# EAGLE design breakout (EAGLE 6.5.0)
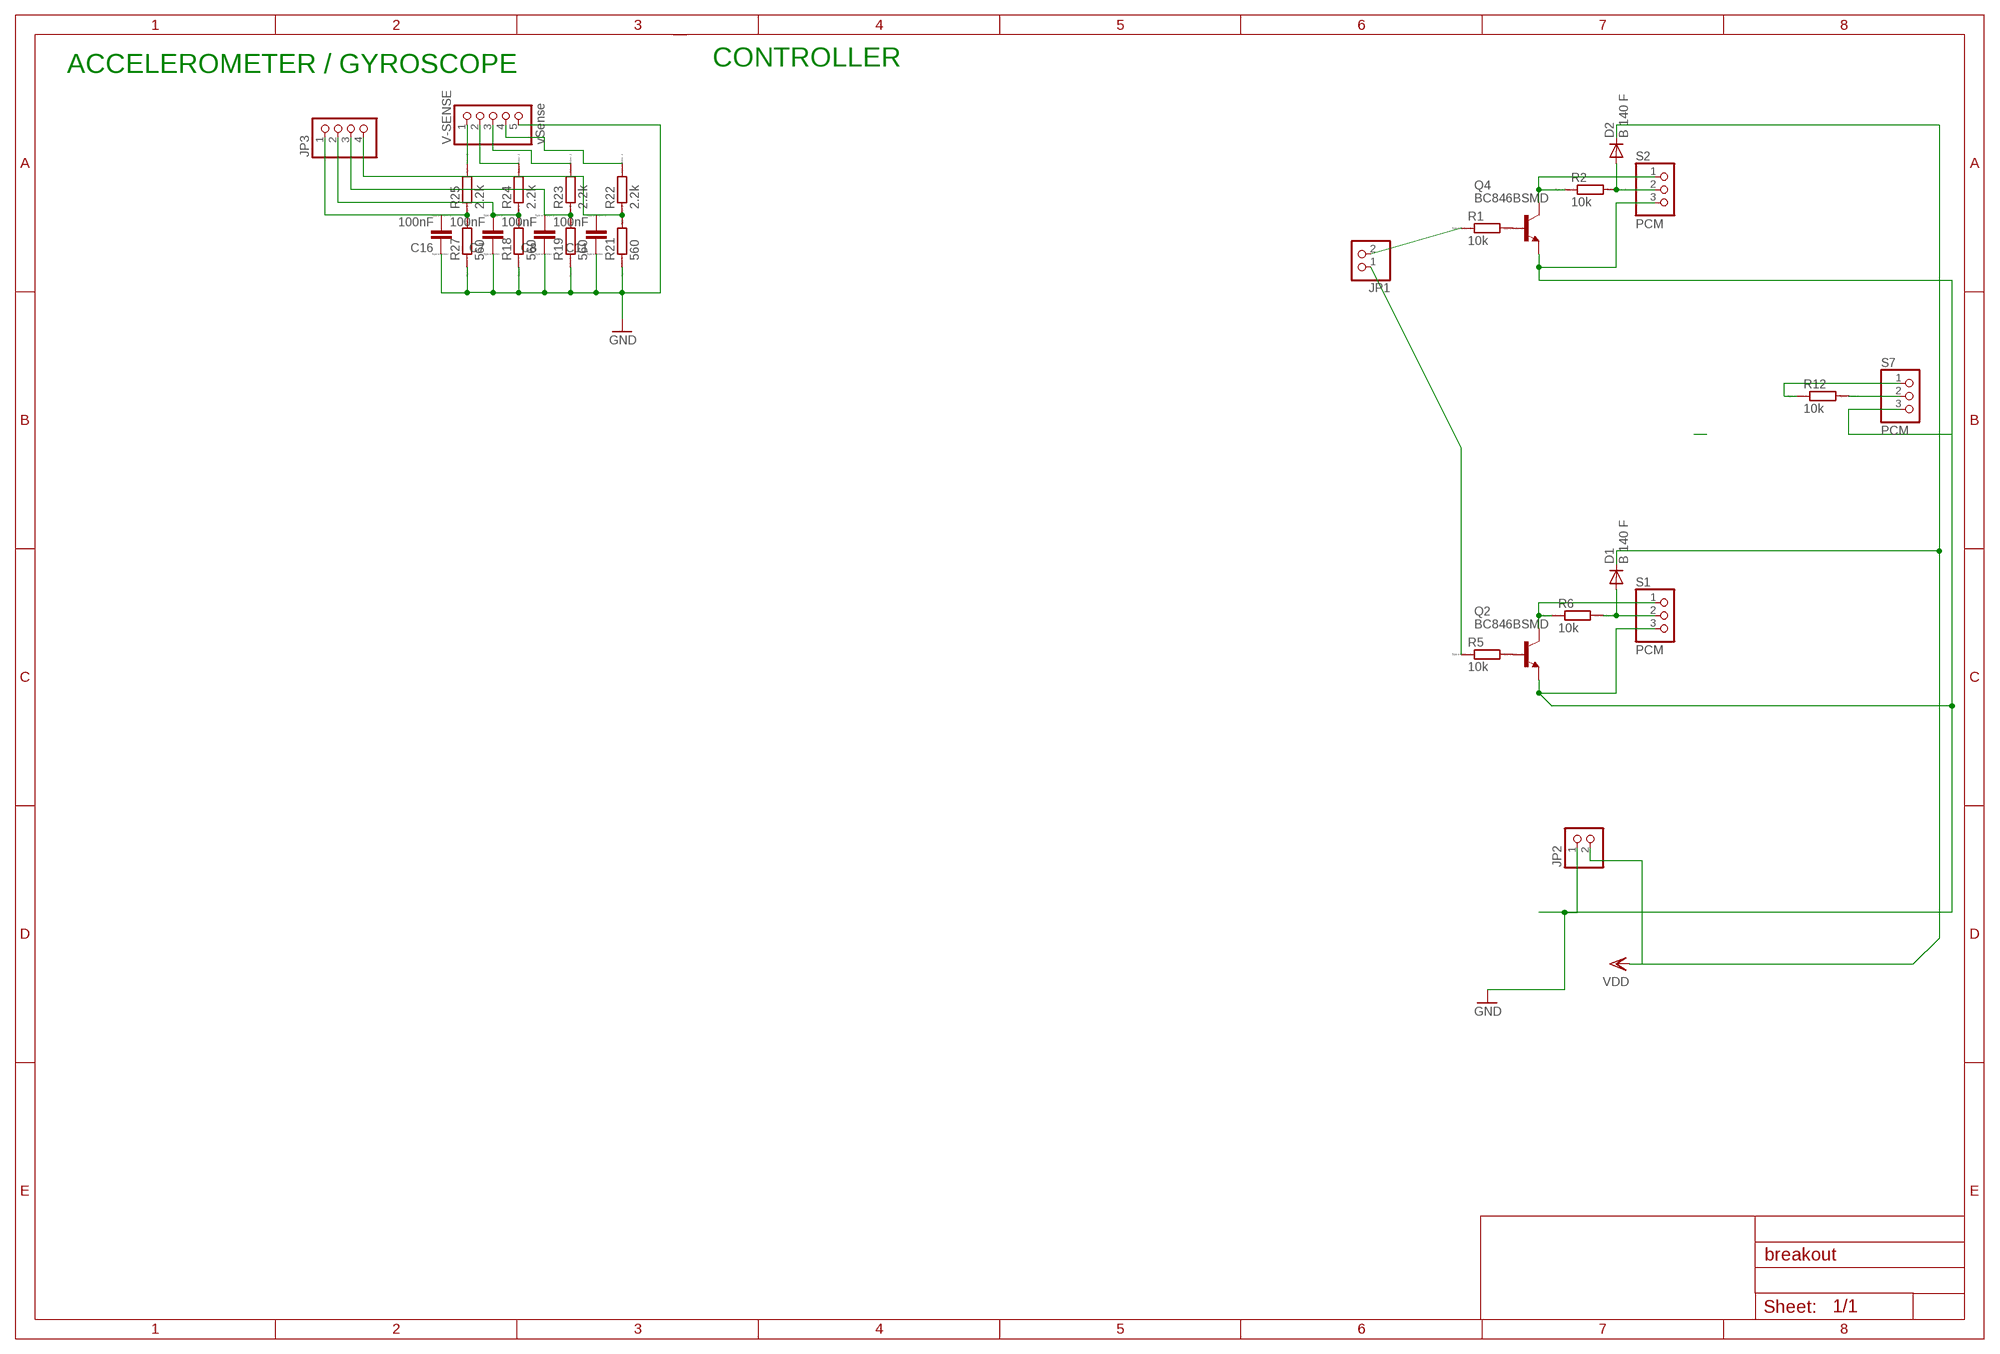
[diagram p0: schematic, sheet 1]

## Parts
C7  100nF  CC0603  [C0603]
C8  100nF  CC0603  [C0603]
C11  100nF  CC0603  [C0603]
C16  100nF  CC0603  [C0603]
D1  B 140 F  CGRM4001-G  [SOD-123_MINI-SMA]
D2  B 140 F  CGRM4001-G  [SOD-123_MINI-SMA]
JP1  PINHD-1X2  [1X02]
JP2  PINHD-1X2  [1X02]
JP3  PINHD-1X4  [1X04]
Q2  BC846BSMD  [SOT23]
Q4  BC846BSMD  [SOT23]
R1  10k  RR0603  [R0603]
R2  10k  RR0603  [R0603]
R5  10k  RR0603  [R0603]
R6  10k  RR0603  [R0603]
R12  10k  RR0603  [R0603]
R18  560  RR0603  [R0603]
R19  560  RR0603  [R0603]
R21  560  RR0603  [R0603]
R22  2.2k  RR0603  [R0603]
R23  2.2k  RR0603  [R0603]
R24  2.2k  RR0603  [R0603]
R25  2.2k  RR0603  [R0603]
R27  560  RR0603  [R0603]
S1  PCM  PINHD-1X3  [1X03]
S2  PCM  PINHD-1X3  [1X03]
S7  PCM  PINHD-1X3  [1X03]
V-SENSE  vSense  PINHD-1X5/90  [1X05/90]

## Nets
GND: C7.1 C8.1 C11.1 C16.1 JP2.1 Q2.2(E) Q4.2(E) R18.1 R19.1 R21.1 R27.1 S1.3 S2.3 S7.3 V-SENSE.5
N$1: Q4.1(B) R1.2
N$5: Q2.3(C) R6.1 S1.1
N$6: D1.A R6.2 S1.2
N$7: Q2.1(B) R5.2
N$14: Q4.3(C) R2.1 S2.1
N$15: D2.A R2.2 S2.2
N$16: R12.1 S7.1
N$17: R12.2 S7.2
N$25: JP1.2 R1.1
N$29: JP1.1 R5.1
N$42: R24.2 V-SENSE.2
N$43: R23.2 V-SENSE.3
N$44: R22.2 V-SENSE.4
N$50: R25.2 V-SENSE.1
PB0: C16.2 JP3.1 R25.1 R27.2
PB1: C7.2 JP3.2 R18.2 R24.1
PB2: C8.2 JP3.3 R19.2 R23.1
PB3: C11.2 JP3.4 R21.2 R22.1
VDD: D1.C D2.C JP2.2

## Notes on the sheet
- ACCELEROMETER / GYROSCOPE | CONTROLLER

## Library data of the parts
C7 C8 C11 C16 = eagle-ltspice:C: CAPACITOR, European symbol; SPICEMODEL: NONE; SPICEPREFIX: C
D1 D2 = diode:CGRM400*-G: Molded plasitc,JEDEC SOD-123/Mini SMA Source: Comchip CGRM4001-G.pdf
JP1 JP2 = pinhead:PINHD-1X2: PIN HEADER
JP3 = pinhead:PINHD-1X4: PIN HEADER
Q2 Q4 = transistor-npn:BC846*: NPN Transistor
R1 R2 R5 R6 R12 R18 R19 R21-R25 R27 = eagle-ltspice:R: RESISTOR, European symbol; SPICEMODEL: NONE; SPICEPREFIX: R
S1 S2 S7 = pinhead:PINHD-1X3: PIN HEADER
V-SENSE = pinhead:PINHD-1X5: PIN HEADER

## Net classes
0 gnd: width 0.305 mm, drill 0.5 mm, clearance 0.203 mm

## Board
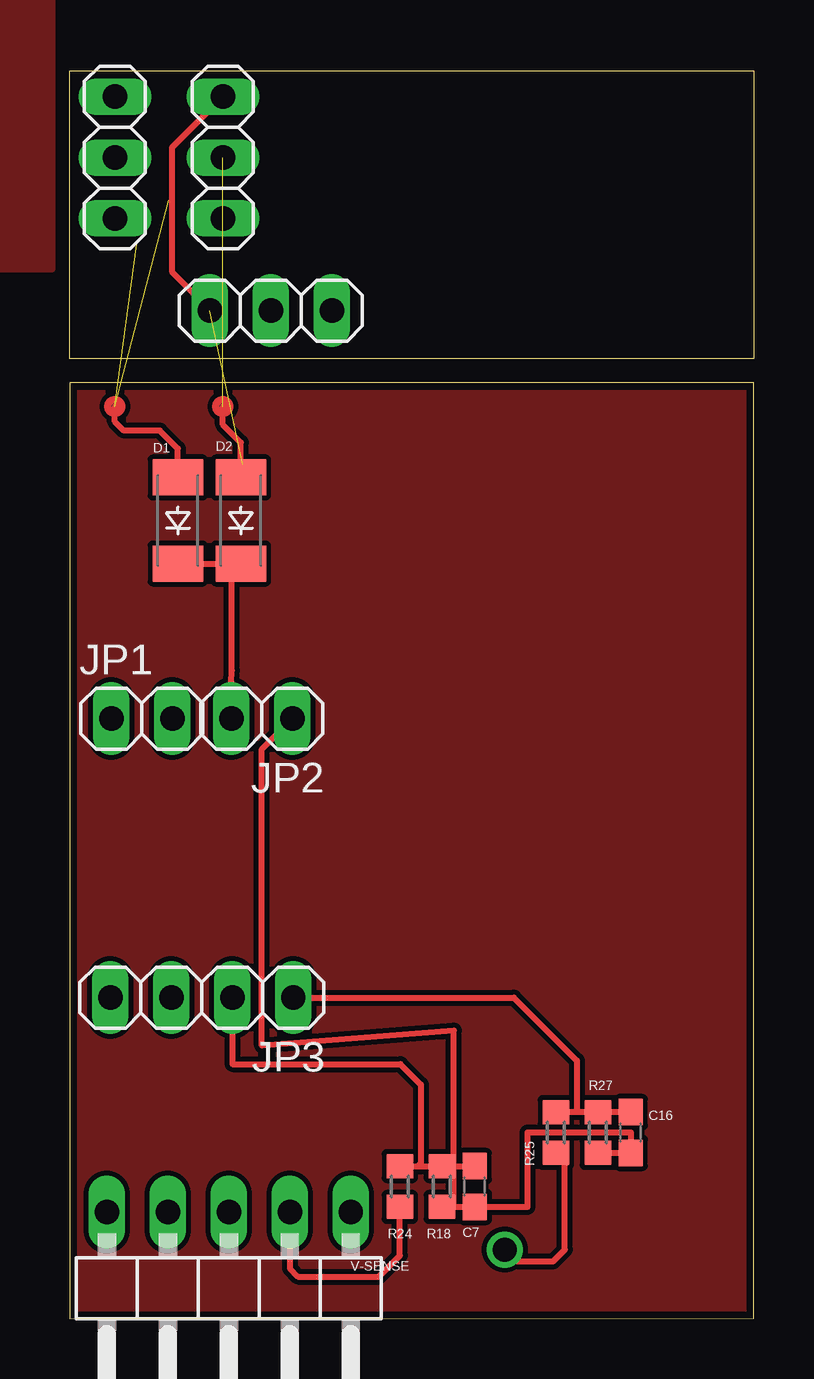
[diagram p1: board, top side]
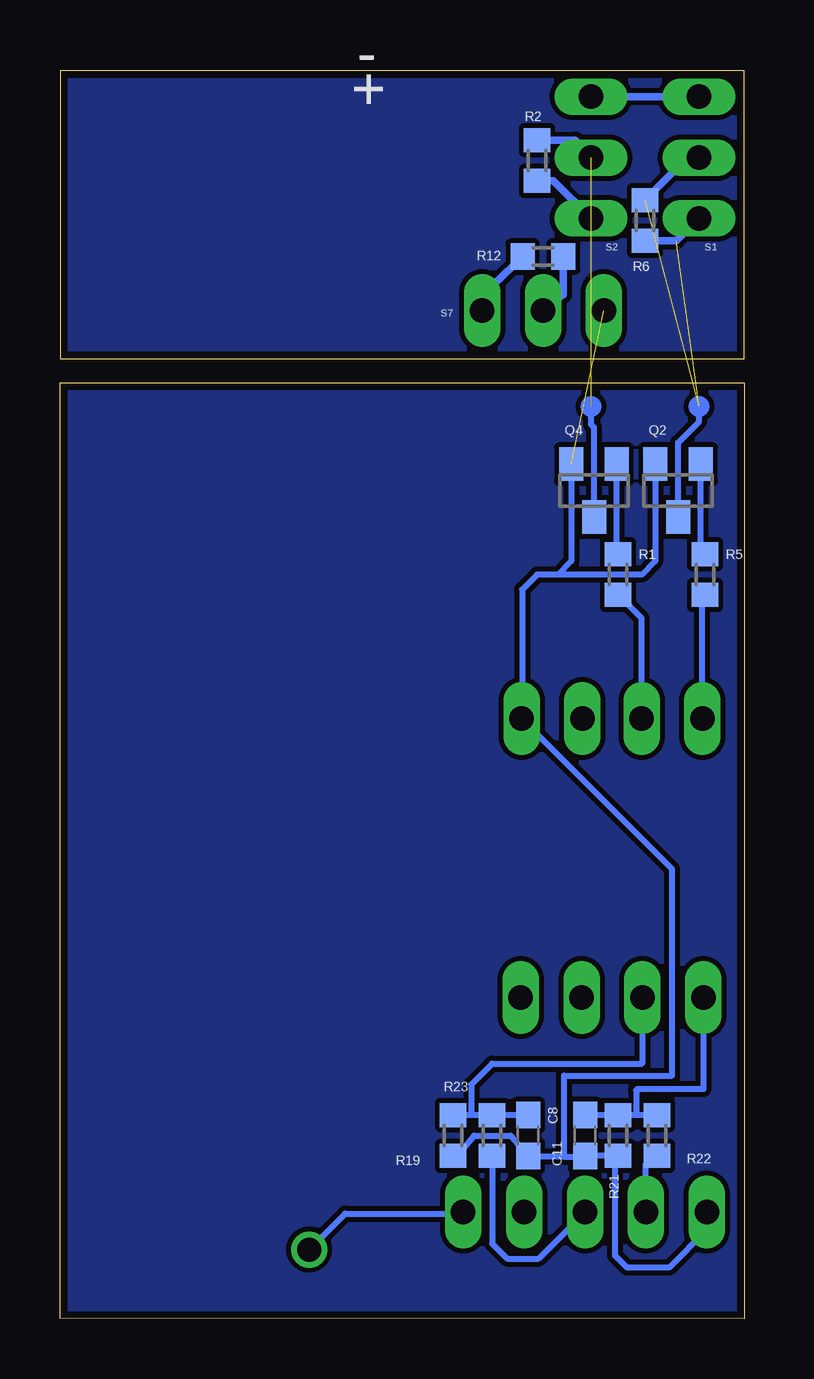
[diagram p2: board, bottom side, seen from below]

Size 28.5 x 52 mm. Coordinates in mm from the lower left corner, seen from the top.
Outline: 28.5,39 0,39 0,0 28.5,0.01 28.5,39
Outline: 0,52 28.5,52 28.5,40 0,40 0,52
Copper layers (1*2+3*4+5*6+7*16): Top 0.035mm / dielectric 0.2mm / Route2 0.035mm / dielectric 0.15mm / Route3 0.035mm / dielectric 0.2mm / Route4 0.035mm / dielectric 0.15mm / Route5 0.035mm / dielectric 0.2mm / Route6 0.035mm / dielectric 0.15mm / Route7 0.035mm / dielectric 0.2mm / Bottom 0.035mm
Design rules "Eagle_WEdirekt_150_check": minimum track width 6mil, minimum drill 0.25mm, track to track 6mil, track to pad 8mil, pad to pad 8mil, via to via 6mil, smd to smd 8mil, copper to edge 12mil, drill to drill 24mil, minimum pad ring 9mil, minimum via ring 9mil, stop-mask expansion 3mil, vias tented up to drill 0mil, thermal gap 12mil

### Footprints (pad centres in the part's own frame; a part is rotated, then mirrored left to right if it is on the bottom)
C0603 = smd 1.1 x 1: 1 -0.85,0; 2 0.85,0
SOD-123_MINI-SMA = smd 1.5 x 2.1: A 1.8,0; C -1.8,0
1X02 = drill 1.016 long: 1 -1.27,0; 2 1.27,0
1X04 = drill 1.016 long: 1 -3.81,0; 2 -1.27,0; 3 1.27,0; 4 3.81,0
SOT23 = smd 1 x 1.4: 1 -0.95,-1.1; 2 0.95,-1.1; 3 0,1.1
R0603 = smd 1 x 1.1: 1 -0.85,0; 2 0.85,0
1X03 = drill 1.016 long: 1 -2.54,0; 2 0,0; 3 2.54,0
1X05/90 = drill 1.016 long: 1 -5.08,-3.81; 2 -2.54,-3.81; 3 0,-3.81; 4 2.54,-3.81; 5 5.08,-3.81

### Placement (x,y rotation side)
C7  16.88,5.5 90 top
C8  9,7.62 90 bottom
C11  6.62,7.62 90 bottom
C16  23.38,7.75 90 top
D1  4.5,33.25 90 top
D2  7.12,33.25 90 top
JP1  3,25 0 top
JP2  8,25 180 top
JP3  5.5,13.38 180 top
Q2  2.75,34.5 180 bottom
Q4  6.25,34.5 180 bottom
R1  5.25,31 90 bottom
R2  8.62,48.25 90 bottom
R5  1.62,31 90 bottom
R6  4.12,45.75 90 bottom
R12  8.38,44.25 0 bottom
R18  15.5,5.5 90 top
R19  12.12,7.62 90 bottom
R21  5.25,7.62 90 bottom
R22  3.62,7.62 270 bottom
R23  10.5,7.62 270 bottom
R24  13.75,5.5 270 top
R25  20.25,7.75 270 top
R27  22,7.75 90 top
S1  1.88,48.38 90 top
S2  6.38,48.38 90 top
S7  8.38,42 180 top
V-SENSE  6.62,0.62 180 top

### Tracks (layer width: path | path; a pad name or v marks a point on that pad's centre or on a via)
GND  (1 unrouted)
  Top 0.254: R27.1 C16.1 23.38,7.75 19.06,7.75 19.06,4.65 C7.1 16,4.65 | R18.1 16,4.65 | 16,4.65 16,12 8,11.38 8,23.73 JP2.1 | S2.3 4.25,48.79 4.25,43.62 5.83,42.04 S7.3
  Bottom 0.254: 7.75,31 4.25,31 3.7,31.55 Q2.2 | 7.75,31 8.62,31 9.25,30.38 9.25,25.02 JP2.1 3,18.73 3,10.12 7.5,10.12 7.5,6.75 | 7.75,31 7.2,31.55 Q4.2 | R19.1 11.9,6.5 11.9,6.85 11.25,7.62 9.72,7.62 C8.1 8.47,6.75 7.5,6.75 | 7.5,6.75 6.65,6.75 C11.1 R21.1 5.38,6.65 5.38,2.62 4.88,2.12 3.12,2.12 1.54,3.71 V-SENSE.5
  Bottom 0.305: S1.3 S2.3
N$1
  Bottom 0.254: R1.2 5.3,32.02 Q4.1
N$2
  pour Bottom: 0,39 28.5,39 28.5,0 0,0
N$3
  pour Top: 0,39 28.5,39 28.5,0 0,0
N$5  (1 unrouted)
  Bottom 0.254: Q2.3 2.75,36.5 1.88,37.38 1.88,38
  Bottom 0.305: R6.1 2.81,44.9 S1.1
N$6  (1 unrouted)
  Top 0.254: D1.A 4.5,36.25 3.75,37 2.25,37 1.88,37.38 1.88,38
  Bottom 0.305: R6.2 2.4,48.35 S1.2
N$7
  Bottom 0.254: R5.2 1.8,32.02 Q2.1
N$14  (1 unrouted)
  Bottom 0.254: Q4.3 6.25,37.12 6.38,37.25 6.38,38
  Bottom 0.305: R2.1 7.94,47.4 S2.1
N$15  (1 unrouted)
  Top 0.254: D2.A 7.12,36.5 6.38,37.25 6.38,38
  Bottom 0.305: R2.2 7.03,49.1 S2.2
N$16
  Bottom 0.305: R12.1 10.85,42.69 S7.1
N$17
  Bottom 0.305: R12.2 7.53,42.65 S7.2
N$25
  Bottom 0.254: JP1.2 4.27,29.17 R1.1
N$29
  Bottom 0.254: JP1.1 1.73,30.05 R5.1
N$42
  Top 0.254: V-SENSE.2 9.16,2.08 9.5,1.75 12.88,1.75 13.75,2.62 R24.2
N$43
  Bottom 0.254: R23.2 10.5,3.12 9.88,2.5 8.56,2.5 V-SENSE.3
N$44
  Bottom 0.254: V-SENSE.4 4.08,6.44 R22.2
N$50  (via drill 1)
  Top 0.254: R25.2 20.62,6.4 20.62,2.88 20.12,2.38 18.62,2.38 v18.12,2.88
  Bottom 0.254: v18.12,2.88 16.62,4.38 11.77,4.38 V-SENSE.1
PB0
  Top 0.254: C16.2 R27.2 21.15,8.6 21.12,8.62 | JP3.1 18.5,13.38 21.12,10.75 21.12,8.62 | R25.1 20.27,8.62 21.12,8.62
PB1
  Top 0.254: C7.2 R18.2 14.5,6.35 | R24.1 14.5,6.35 | JP3.2 6.77,10.61 13.77,10.61 14.62,9.75 14.62,6.47 14.5,6.35
PB2
  Bottom 0.254: C8.2 R23.1 11.38,8.47 | 11.38,8.47 R19.2 | JP3.3 4.25,10.62 10.5,10.62 11.38,9.75 11.38,8.47
PB3
  Bottom 0.254: C11.2 R21.2 4.5,8.47 | R22.1 4.5,8.47 | JP3.4 1.69,9.56 4.43,9.56 4.5,9.5 4.5,8.47
POLY1
  pour Bottom: 0.12,51.88 28.38,51.88 28.38,40.12 0.12,40.12
POLY2
  pour Top: -0.75,55.75 -4.25,55.75 -4.25,43.75 -0.75,43.75
VDD
  Top 0.254: 4.25,31.45 D1.C 6.75,31.45 | 6.75,31.45 D2.C | 6.75,31.45 6.75,27 6.73,26.52 JP2.2
(copper drawn outside any net)
  shapes: Bottom circle x2, Top circle x2

### Text on the board
bNames: - | +